# EAGLE board RTxController (EAGLE 6.5.0)
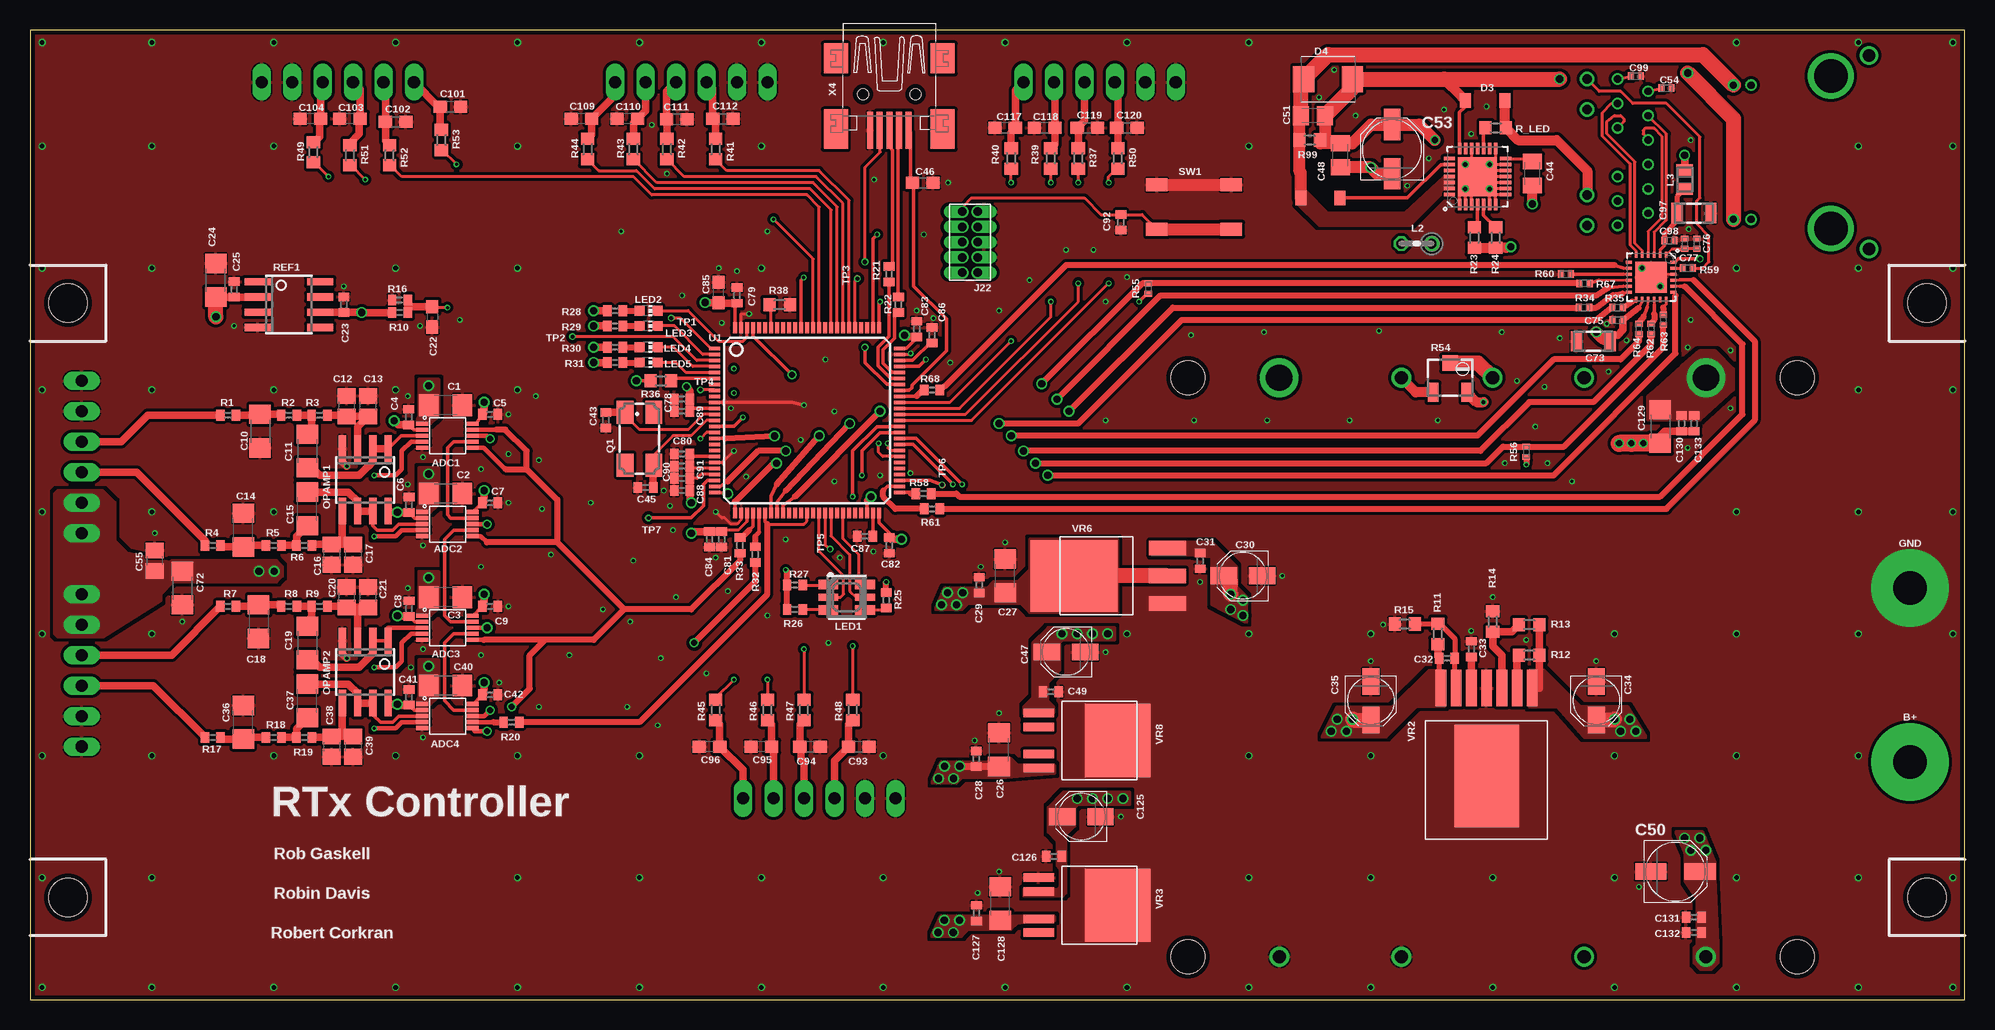
[diagram p4: board, top side]
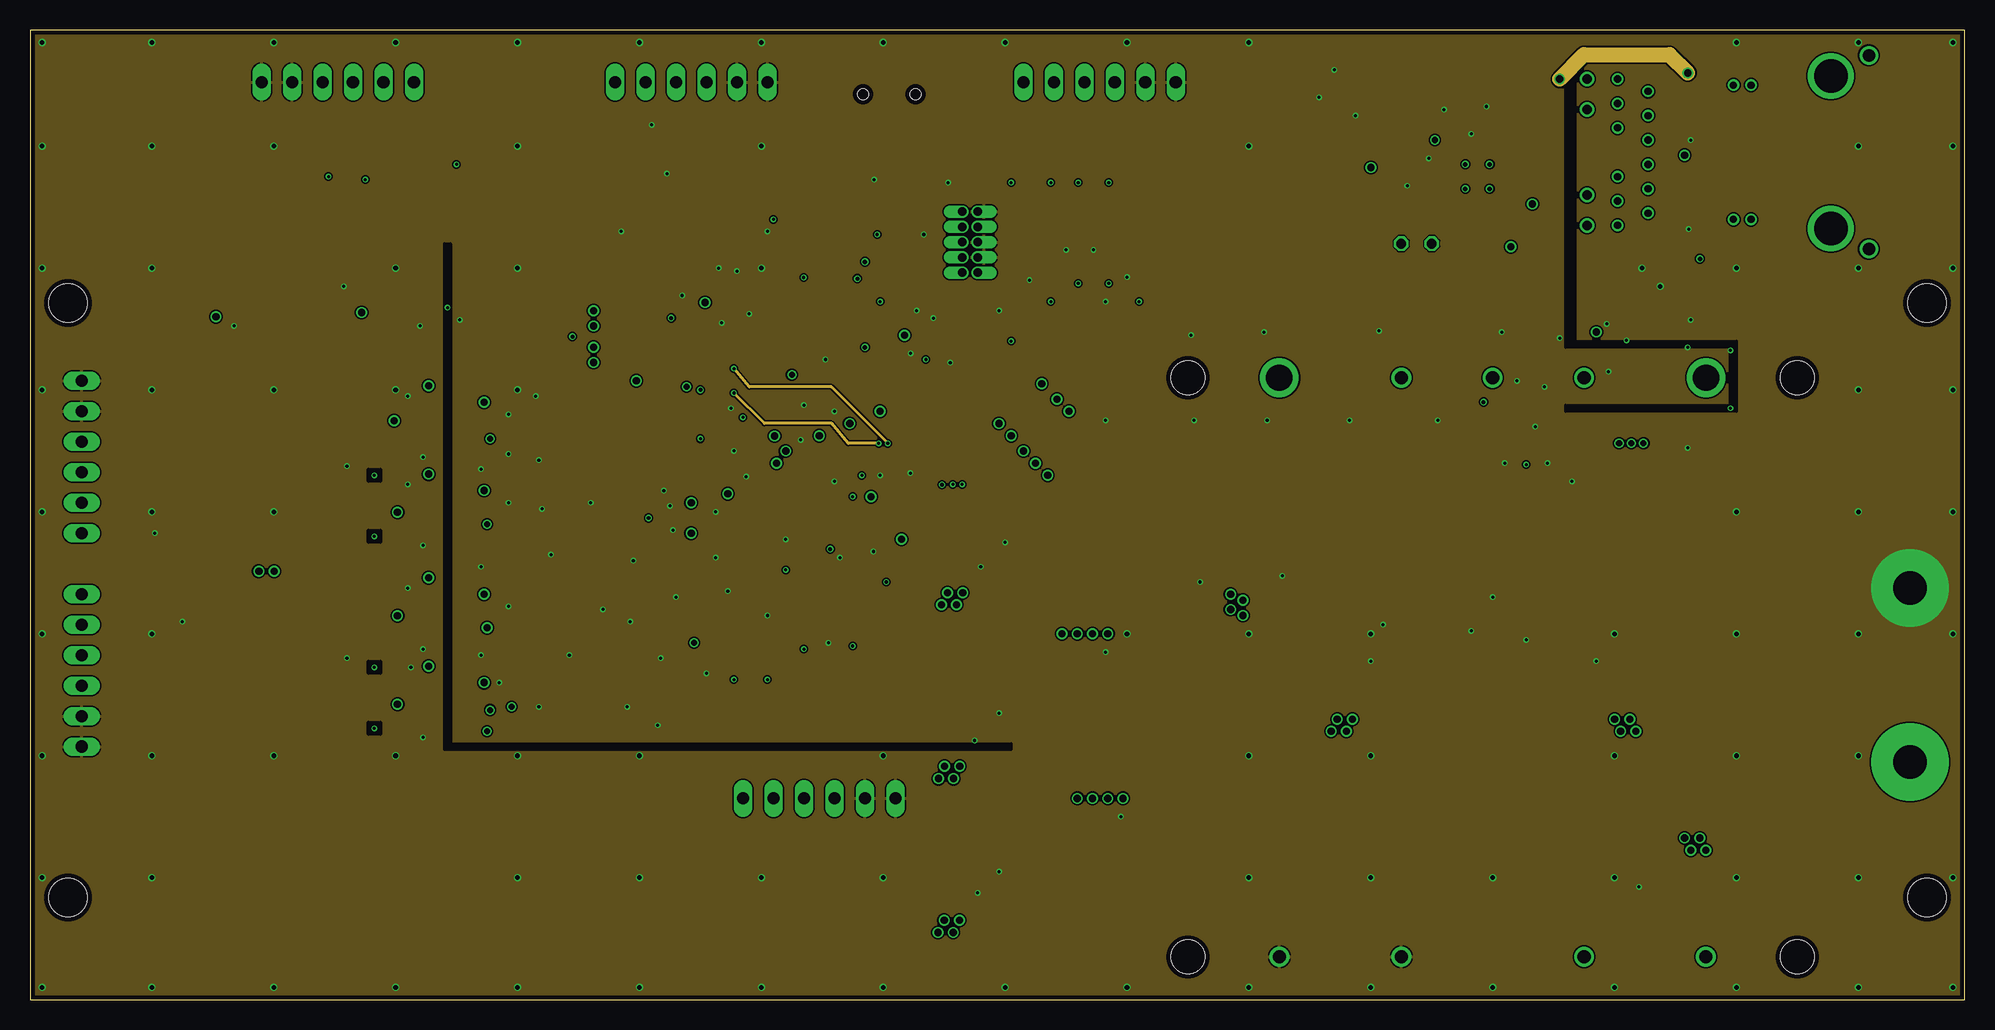
[diagram p5: board, inner layer Route2]
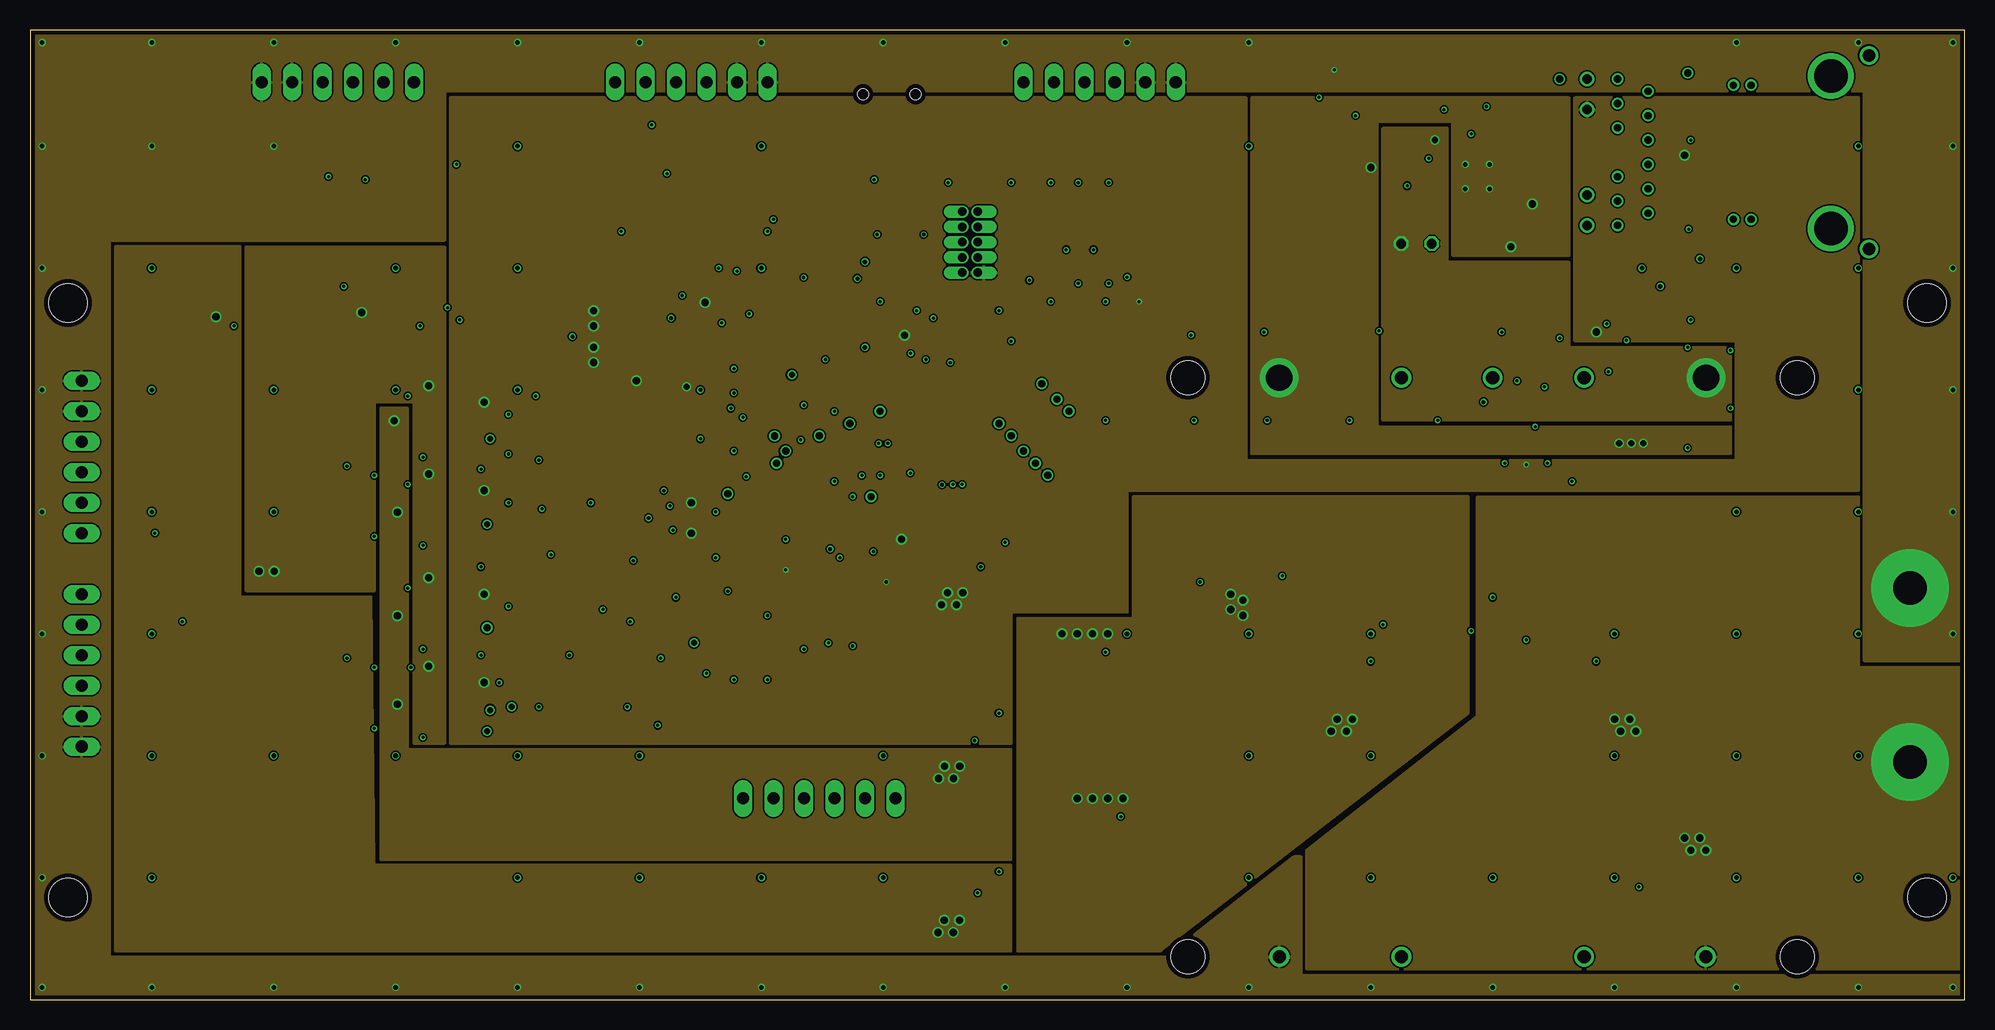
[diagram p6: board, inner layer Route3]
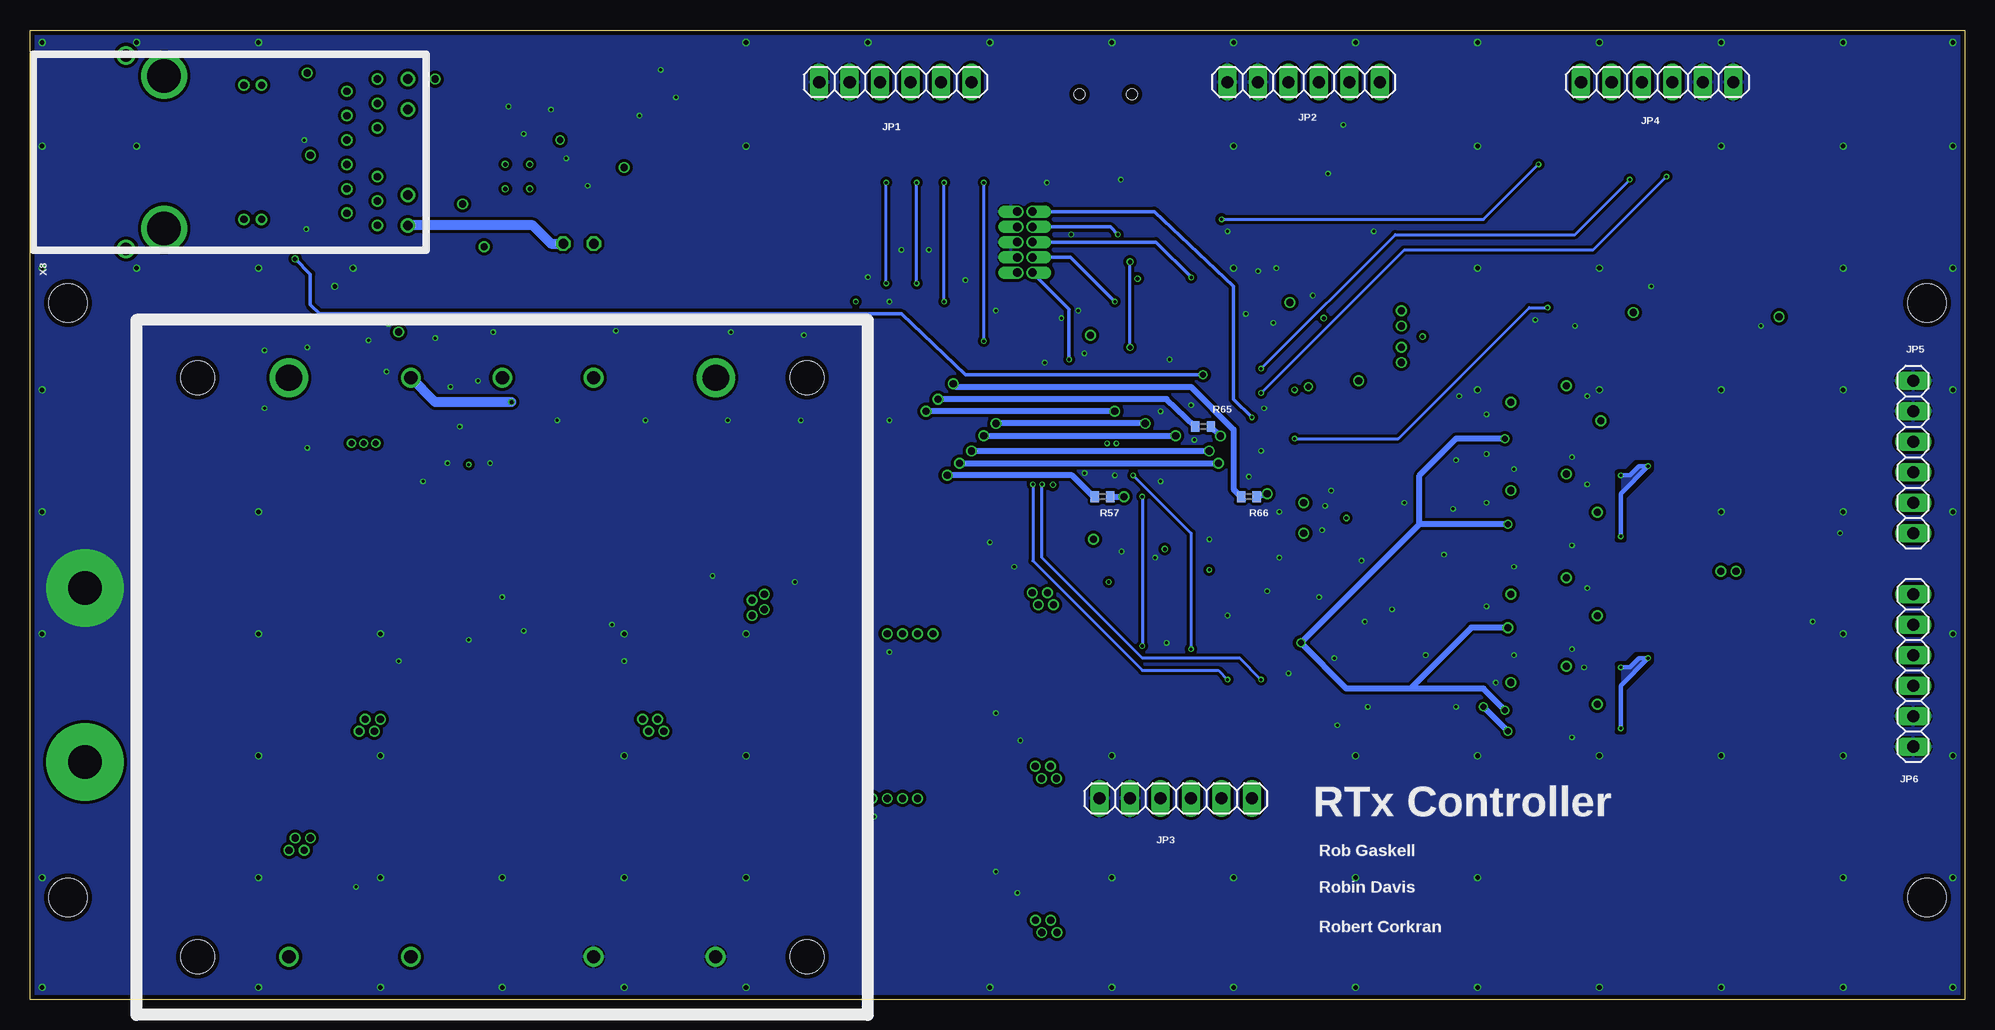
[diagram p7: board, bottom side, seen from below]

Size 161.29 x 80.8 mm. Coordinates in mm from the lower left corner, seen from the top.
Outline: 0,0 161.29,0 161.29,80.8 0,80.8 0,0
Copper layers (1+2*3+16): Top 0.035559375mm / dielectric 0.17018125mm / Route2 0.01778125mm / dielectric 47mil / Route3 0.0356mm / dielectric 0.2007mm / Bottom 0.035559375mm
Design rules "osh-park-4layer *": minimum track width 5mil, minimum drill 10mil, track to track 5mil, track to pad 5mil, pad to pad 5mil, via to via 5mil, smd to smd 5mil, copper to edge 15mil, drill to drill 5mil, minimum pad ring 7mil, minimum via ring 4mil, stop-mask expansion 3mil, vias tented up to drill 30mil, thermal gap 5mil
Net classes: 0 default: width 0.127 mm, drill 0.203 mm, clearance 0.127 mm; 1 PWR: width 0.127 mm, drill 0.203 mm, clearance 0.127 mm to class 0, clearance 0.127 mm
Holes 3.17 mm at 3.17,58.04 3.17,8.51 158.12,58.04 158.12,8.51
tRestrict: 40 lines
bRestrict: 16 lines

## Footprints (pad centres in the part's own frame; a part is rotated, then mirrored left to right if it is on the bottom)
MSOP-10 = smd 1.016 x 0.356: 1 -2.1,1; 2 -2.1,0.5; 3 -2.1,0; 4 -2.1,-0.5; 5 -2.1,-1; 6 2.1,-1; 7 2.1,-0.5; 8 2.1,0; 9 2.1,0.5; 10 2.1,1
TERMINAL_RELAY = drill 2.8 pad 6.452: P$1 0,0
C1206 = smd 1.6 x 1.8: 1 -1.4,0; 2 1.4,0
C0402 = smd 0.7 x 0.9: 1 -0.65,0; 2 0.65,0
C0805 = smd 1.3 x 1.5: 1 -0.85,0; 2 0.85,0
C0603 = smd 1.1 x 1: 1 -0.85,0; 2 0.85,0
PANASONIC_B = smd 2.2 x 1.4: + 1.6,0; - -1.6,0
C0805K = smd 1.3 x 1.6: 1 -1,0; 2 1,0
PANASONIC_C = smd 2.6 x 1.4: + 2.05,0; - -2.05,0
0402-C-NOSILK = smd 0.49 x 0.62: 1 -0.43,0; 2 0.43,0
1206-C = smd 0.95 x 1.7: 1 -1.4,0; 2 1.4,0
SOD-123 = smd 0.914 x 1.219: P$1 0,0; P$2 3.277,0
SMBJ = smd 1.78 x 2.16: A 2.04,0; C -2.03,0
TQFN-28 = smd 0.3 x 0.95: 1 -1.5,-2.34; 2 -1,-2.34; 3 -0.5,-2.34; 4 0,-2.34; 5 0.5,-2.34; 6 1,-2.34; 7 1.5,-2.34; 15 1.5,2.34; 16 1,2.34; 17 0.5,2.34; 18 0,2.34; 19 -0.5,2.34; 20 -1,2.34; 21 -1.5,2.34 | smd 0.95 x 0.3: 8 2.34,-1.5; 9 2.34,-1; 10 2.34,-0.5; 11 2.34,0; 12 2.34,0.5; 13 2.34,1; 14 2.34,1.5; 22 -2.34,1.5; 23 -2.34,1; 24 -2.34,0.5; 25 -2.34,0; 26 -2.34,-0.5; 27 -2.34,-1; 28 -2.34,-1.5 | smd 3.25 x 3.25: PAD 0,0
1.27MM_2X5 = drill 0.7 pad 1.016 offset: !RESET 1.27,-1.905; GND 0,1.905; GND@2 0,0.635; GNDDET 0,-1.905; NC/KEY 0,-0.635; TCK 1.27,1.905; TDI 1.27,-0.635; TDO 1.27,0.635; TMS 1.27,3.175; VTREF 0,3.175
1X06 = drill 1.016 long: 1 -6.35,0; 2 -3.81,0; 3 -1.27,0; 4 1.27,0; 5 3.81,0; 6 6.35,0
0204V = drill 0.813 octagon: 1 -1.27,0; 2 1.27,0
0805-C-NOSILK = smd 0.95 x 1.35: 1 -0.8,0; 2 0.8,0
PLCC-6 = smd 1.65 x 0.8: 1 -1.525,1.05; 3 -1.525,-1.05; 4 1.525,-1.05; 6 1.525,1.05 | smd 1.65 x 0.6: 2 -1.525,0; 5 1.525,0
CHIP-LED0603 = smd 0.8 x 0.8: A 0,-0.75; C 0,0.75
SOIC8 = smd 0.6 x 2.2: 1 -1.905,-2.6; 2 -0.635,-2.6; 3 0.635,-2.6; 4 1.905,-2.6; 5 1.905,2.6; 6 0.635,2.6; 7 -0.635,2.6; 8 -1.905,2.6
CHB75W = drill 1.1: 1 24.13,-17.78; 2 24.13,-7.62; 3 24.13,7.62; 4 24.13,17.78; 6 -24.13,7.62; 7 -24.13,0; 8 -24.13,-7.62 | drill 2.2: 5 -24.13,17.78; 9 -24.13,-17.78 | hole 2.8: 24.13,25.4; -24.13,25.4; 24.13,-25.4; -24.13,-25.4
CTS406 = smd 1.9 x 1.4: 1 -2.2,-1.2; 2 2.2,-1.2; 3 2.2,1.2; 4 -2.2,1.2
R0402 = smd 0.7 x 0.9: 1 -0.65,0; 2 0.65,0
R0603 = smd 1 x 1.1: 1 -0.85,0; 2 0.85,0
3223W = smd 0.9 x 1.6: 1 -1.4,-1.215; 3 1.4,-1.215 | smd 1.3 x 1.3: 2 0,1.215
COM08720 = smd 1.8 x 1.1: 1 -3.1,1.85; 2 -3.1,-1.85; 3 3.1,1.85; 4 3.1,-1.85
TP06R = smd 0.6 x 0.6: TP 0,0
LQFP-100 = smd 0.9 x 0.3: 1 -7.72,6; 2 -7.72,5.5; 3 -7.72,5; 4 -7.72,4.5; 5 -7.72,4; 6 -7.72,3.5; 7 -7.72,3; 8 -7.72,2.5; 9 -7.72,2; 10 -7.72,1.5; 11 -7.72,1; 12 -7.72,0.5; 13 -7.72,0; 14 -7.72,-0.5; 15 -7.72,-1; 16 -7.72,-1.5; 17 -7.72,-2; 18 -7.72,-2.5; 19 -7.72,-3; 20 -7.72,-3.5; 21 -7.72,-4; 22 -7.72,-4.5; 23 -7.72,-5; 24 -7.72,-5.5; 25 -7.72,-6; 51 7.72,-6; 52 7.72,-5.5; 53 7.72,-5; 54 7.72,-4.5; 55 7.72,-4; 56 7.72,-3.5; 57 7.72,-3; 58 7.72,-2.5; 59 7.72,-2; 60 7.72,-1.5; 61 7.72,-1; 62 7.72,-0.5; 63 7.72,0; 64 7.72,0.5; 65 7.72,1; 66 7.72,1.5; 67 7.72,2; 68 7.72,2.5; 69 7.72,3; 70 7.72,3.5; 71 7.72,4; 72 7.72,4.5; 73 7.72,5; 74 7.72,5.5; 75 7.72,6 | smd 0.3 x 0.9: 26 -6,-7.72; 27 -5.5,-7.72; 28 -5,-7.72; 29 -4.5,-7.72; 30 -4,-7.72; 31 -3.5,-7.72; 32 -3,-7.72; 33 -2.5,-7.72; 34 -2,-7.72; 35 -1.5,-7.72; 36 -1,-7.72; 37 -0.5,-7.72; 38 0,-7.72; 39 0.5,-7.72; 40 1,-7.72; 41 1.5,-7.72; 42 2,-7.72; 43 2.5,-7.72; 44 3,-7.72; 45 3.5,-7.72; 46 4,-7.72; 47 4.5,-7.72; 48 5,-7.72; 49 5.5,-7.72; 50 6,-7.72; 76 6,7.72; 77 5.5,7.72; 78 5,7.72; 79 4.5,7.72; 80 4,7.72; 81 3.5,7.72; 82 3,7.72; 83 2.5,7.72; 84 2,7.72; 85 1.5,7.72; 86 1,7.72; 87 0.5,7.72; 88 0,7.72; 89 -0.5,7.72; 90 -1,7.72; 91 -1.5,7.72; 92 -2,7.72; 93 -2.5,7.72; 94 -3,7.72; 95 -3.5,7.72; 96 -4,7.72; 97 -4.5,7.72; 98 -5,7.72; 99 -5.5,7.72; 100 -6,7.72
QFN-24 = smd 0.23 x 0.48: 1 -1.25,-1.86; 2 -0.75,-1.86; 3 -0.25,-1.86; 4 0.25,-1.86; 5 0.75,-1.86; 6 1.25,-1.86; 13 1.25,1.86; 14 0.75,1.86; 15 0.25,1.86; 16 -0.25,1.86; 17 -0.75,1.86; 18 -1.25,1.86 | smd 0.48 x 0.23: 7 1.86,-1.25; 8 1.86,-0.75; 9 1.86,-0.25; 10 1.86,0.25; 11 1.86,0.75; 12 1.86,1.25; 19 -1.86,1.25; 20 -1.86,0.75; 21 -1.86,0.25; 22 -1.86,-0.25; 23 -1.86,-0.75; 24 -1.86,-1.25 | smd 2.6 x 2.6: PAD 0,0
PFM-7 = smd 0.889 x 3.048: 1 -3.81,-7.671; 2 -2.54,-7.671; 3 -1.27,-7.671; 4 0,-7.671; 5 1.27,-7.671; 6 2.54,-7.671; 7 3.81,-7.671 | smd 5.359 x 8.534: PAD 0,-0.356
PG-TO252-5-11 = smd 0.711 x 2.54: 1 -2.286,-5.08; 2 -1.143,-5.08; 4 1.143,-5.08; 5 2.286,-5.08 | smd 6.096 x 5.461: 3 0,1.499
PG-TO252-3-11 = smd 3.064 x 1.2: 1 5.918,-2.286; 2 5.918,0; 3 5.918,2.311 | smd 7.269 x 5.969: 4 -1.88,0
32005-301 = smd 3.1 x 0.5: 1 3,1.6; 2 3,0.8; 3 3,0; 4 3,-0.8; 5 3,-1.6 | smd 2.5 x 2: M1 -3,-4.45; M2 -3,4.45 | smd 3.3 x 2: M3 2.9,4.45; M4 2.9,-4.45 | hole 0.9: 0,2.2; 0,-2.2
MAGJACK-RJ45 = drill 0.6 pad 0.889: 1 -5.08,-15.24; 2 -3.048,-15.24; 3 -1.016,-15.24; 4 1.016,-15.24; 5 3.048,-15.24; 6 5.08,-15.24; 7 -6.096,-17.78; 8 -4.064,-17.78; 9 -2.032,-17.78; 10 2.032,-17.78; 11 4.064,-17.78; 12 6.096,-17.78; 13 -5.588,-8.128; 14 5.588,-8.128; 15 -5.588,-6.655; 16 5.588,-6.655 | drill 0.8 pad 1.016: 17 -6.096,-20.32; 18 -3.556,-20.32; 19 3.556,-20.32; 20 6.096,-20.32 | drill 1.016 pad 1.575: SHIELD1 -8.065,3.175; SHIELD2 8.065,3.175 | drill 2.8 pad 3.251: SHIELD3 -6.35,0; SHIELD4 6.35,0

## Placement (x,y rotation side)
ADC1  AD7685RM-10  [MSOP-10]  34.8,46.99 0 top
ADC2  AD7685RM-10  [MSOP-10]  34.8,39.62 0 top
ADC3  AD7685RM-10  [MSOP-10]  34.8,30.99 0 top
ADC4  AD7685RM-10  [MSOP-10]  34.8,23.62 0 top
B+  TERMINAL  [TERMINAL_RELAY]  156.72,19.81 0 top
C1  22u  [C1206]  34.65,49.53 180 top
C2  22u  [C1206]  34.65,42.16 180 top
C3  22u  [C1206]  34.65,33.53 180 top
C4  0.1u  [C0402]  31.57,48.54 90 top
C5  0.1u  [C0402]  38.35,48.77 0 top
C6  0.1u  [C0402]  31.6,41.22 90 top
C7  0.1u  [C0402]  38.35,41.4 0 top
C8  0.1u  [C0402]  31.6,32.59 90 top
C9  0.1u  [C0402]  38.35,32.77 0 top
C10  10u  [C1206]  19.18,47.37 270 top
C11  10u  [C1206]  23.11,45.72 270 top
C12  1u  [C0805]  26.42,49.45 90 top
C13  0.47u  [C0805]  28.19,49.45 90 top
C14  10u  [C1206]  17.78,39.12 90 top
C15  10u  [C1206]  23.11,40.89 90 top
C16  1u  [C0805]  25.15,37.08 270 top
C17  0.47u  [C0805]  26.92,37.08 270 top
C18  10u  [C1206]  19.05,31.5 270 top
C19  10u  [C1206]  23.11,29.72 270 top
C20  1u  [C0805]  26.42,33.53 90 top
C21  0.47u  [C0805]  28.19,33.53 90 top
C22  0.33u  [C0603]  33.53,56.9 270 top
C23  0.1u  [C0402]  26.16,57.91 90 top
C24  10u  [C1206]  15.49,59.94 90 top
C25  0.1u  [C0402]  17.02,59.18 90 top
C26  22u  [C1206]  80.77,20.83 90 top
C27  22u  [C1206]  81.28,35.31 90 top
C28  0.1u  [C0402]  78.87,20.07 90 top
C29  0.1u  [C0402]  79.12,34.54 90 top
C30  10u  [PANASONIC_B]  101.09,35.31 180 top
C31  0.1u  [C0402]  97.54,36.55 270 top
C32  0.022u  [C0402]  118.11,28.45 180 top
C33  4700p  [C0402]  120.14,29.21 270 top
C34  22u 50V  [PANASONIC_B]  130.56,24.89 270 top
C35  47u 16V  [PANASONIC_B]  111.76,24.89 270 top
C36  10u  [C1206]  17.78,23.11 90 top
C37  10u  [C1206]  23.11,24.89 90 top
C38  1u  [C0805]  25.15,21.08 270 top
C39  0.47u  [C0805]  26.92,21.08 270 top
C40  22u  [C1206]  34.65,26.16 180 top
C41  0.1u  [C0402]  31.6,25.2 90 top
C42  0.1u  [C0402]  38.35,25.4 0 top
C43  16p  [C0402]  48.01,48.29 270 top
C44  100nF  [C0805K]  125.22,68.83 270 top
C45  16p  [C0402]  51.31,42.67 180 top
C46  [C0603]  74.42,68.07 0 top
C47  10u  [PANASONIC_B]  86.36,28.96 180 top
C48  0.1uf 100V  [C0805K]  109.22,70.36 270 top
C49  0.1u  [C0402]  85.09,25.65 0 top
C50  47u 50V  [PANASONIC_C]  137.16,10.67 0 top
C51  0.1uf 100V  [C0805K]  106.93,73.66 180 top
C53  47u 100V  [PANASONIC_C]  113.54,70.87 90 top
C54  100n  [0402-C-NOSILK]  136.4,75.95 180 top
C55  1u  [C0805]  10.41,36.58 90 top
C72  22u  [C1206]  12.7,34.29 270 top
C73  22u  [1206-C]  130.3,54.86 0 top
C75  100n  [0402-C-NOSILK]  132.33,56.62 0 top
C76  100n  [0402-C-NOSILK]  138.94,62.99 90 top
C77  2.2u  [0402-C-NOSILK]  137.92,62.99 90 top
C78  0.1u  [C0402]  54.36,50.04 180 top
C79  0.1u  [C0402]  58.93,58.67 90 top
C80  0.1u  [C0402]  54.36,45.47 180 top
C81  0.1u  [C0402]  57.66,38.35 270 top
C82  0.1u  [C0402]  71.63,37.85 270 top
C83  0.1u  [C0402]  73.91,55.88 90 top
C84  0.1u  [C0402]  56.64,38.35 270 top
C85  4.7u  [C0603]  57.4,58.93 90 top
C86  2.2u  [C0402]  75.18,55.37 90 top
C87  2.2u  [C0402]  69.6,38.61 180 top
C88  0.1u  [C0402]  54.36,42.42 180 top
C89  1.0u  [C0402]  54.36,49.02 180 top
C90  0.1u  [C0402]  54.36,43.43 180 top
C91  1.0u  [C0402]  54.36,44.45 180 top
C92  NU  [C0402]  90.93,64.77 270 top
C93  0.1u  [C0603]  69.09,21.08 0 top
C94  0.1u  [C0603]  65.02,21.08 0 top
C95  0.1u  [C0603]  60.96,21.08 180 top
C96  0.1u  [C0603]  56.64,21.08 180 top
C97  22u  [1206-C]  138.68,65.53 180 top
C98  100n  [0402-C-NOSILK]  136.65,63.25 180 top
C99  100n  [0402-C-NOSILK]  133.86,76.96 180 top
C101  0.1u  [C0603]  35.05,74.42 0 top
C102  0.1u  [C0603]  30.48,73.15 0 top
C103  0.1u  [C0603]  26.67,73.41 180 top
C104  0.1u  [C0603]  23.37,73.41 180 top
C109  0.1u  [C0603]  45.97,73.41 180 top
C110  0.1u  [C0603]  49.78,73.41 180 top
C111  0.1u  [C0603]  53.92,73.38 0 top
C112  0.1u  [C0603]  57.76,73.41 0 top
C117  0.1u  [C0603]  81.28,72.64 180 top
C118  0.1u  [C0603]  84.58,72.64 180 top
C119  0.1u  [C0603]  88.14,72.64 0 top
C120  0.1u  [C0603]  91.44,72.64 0 top
C125  10u  [PANASONIC_B]  87.63,15.24 180 top
C126  0.1u  [C0402]  85.34,11.94 180 top
C127  0.1u  [C0402]  78.89,7.21 90 top
C128  22u  [C1206]  80.87,8 90 top
C129  10u 50V  [C1206]  135.89,47.75 270 top
C130  0.1u 50V  [C0402]  137.67,48.01 270 top
C131  0.1u 50V  [C0402]  138.68,6.86 180 top
C132  0.1u 50V  [C0402]  138.68,5.59 180 top
C133  0.1u 50V  [C0402]  138.71,48.01 270 top
D3  1N4448  [SOD-123]  122.94,74.93 180 top
D4  SMAJ58A  [SMBJ]  108.2,76.71 180 top
D5  1N4448  [SOD-123]  105.92,66.8 0 top
GND  TERMINAL  [TERMINAL_RELAY]  156.72,34.29 0 top
IC2  MAX5984A  [TQFN-28]  120.65,68.58 0 top
J22  Debug Header  [1.27MM_2X5]  78.99,63.75 180 top
JP1  [1X06]  89.15,76.45 0 bottom
JP2  [1X06]  55.12,76.45 180 bottom
JP3  [1X06]  65.79,16.76 0 bottom
JP4  [1X06]  25.65,76.45 0 bottom
JP5  [1X06]  4.32,45.21 90 bottom
JP6  [1X06]  4.32,27.43 90 bottom
L2  10m, 21mA  [0204V]  115.57,62.99 180 top
L3  FB0805/600R/200mA(201209-601)  [0805-C-NOSILK]  137.92,68.33 90 top
LED1  [PLCC-6]  68.07,33.53 0 top
LED2  [CHIP-LED0603]  51.56,57.4 270 top
LED3  [CHIP-LED0603]  51.56,56.13 270 top
LED4  [CHIP-LED0603]  51.56,54.36 270 top
LED5  [CHIP-LED0603]  51.56,53.09 270 top
OPAMP1  AD8616R-8  [SOIC8]  27.94,43.31 180 top
OPAMP2  AD8616R-8  [SOIC8]  27.94,27.3 180 top
POE  CHB75W  [CHB75W]  121.92,27.69 270 bottom
Q1  [CTS406]  50.8,46.74 270 top
R1  680  [R0402]  16.51,48.69 0 top
R2  2.2k  [R0402]  21.59,48.69 0 top
R3  1.2k  [R0402]  24.13,48.69 0 top
R4  680  [R0402]  15.24,37.85 0 top
R5  2.2k  [R0402]  20.32,37.85 0 top
R6  1.2k  [R0402]  22.86,37.85 0 top
R7  680  [R0402]  16.51,32.77 0 top
R8  2.2k  [R0402]  21.59,32.77 0 top
R9  1.2k  [R0402]  24.13,32.77 0 top
R10  10k  [R0402]  30.84,57.25 0 top
R11  34k  [R0603]  117.35,30.48 270 top
R12  249k  [R0603]  124.97,28.7 180 top
R13  150k  [R0603]  124.97,31.24 180 top
R14  10k  [R0603]  121.92,31.5 270 top
R15  2.43k  [R0603]  114.6,31.29 0 top
R16  19.1k  [R0402]  30.84,58.29 0 top
R17  680  [R0402]  15.24,21.84 0 top
R18  2.2k  [R0402]  20.32,21.84 0 top
R19  1.2k  [R0402]  22.86,21.84 0 top
R20  33  [R0402]  40.13,23.11 0 top
R21  22  [R0402]  71.6,60.45 270 top
R22  22  [R0402]  72.39,57.91 270 top
R23  1k  [R0603]  120.4,63.5 270 top
R24  1k  [R0603]  122.17,63.5 270 top
R25  750  [R0402]  71.37,33.27 270 top
R26  750  [R0402]  63.75,32.51 0 top
R27  750  [R0402]  63.75,34.54 0 top
R28  750  [R0402]  48.77,57.4 0 top
R29  750  [R0402]  48.77,56.13 0 top
R30  750  [R0402]  48.77,54.36 0 top
R31  750  [R0402]  48.77,53.09 0 top
R32  33  [R0402]  60.45,37.08 90 top
R33  33  [R0402]  59.18,37.85 90 top
R34  33  [0402-C-NOSILK]  129.54,57.66 180 top
R35  33  [0402-C-NOSILK]  132.33,57.66 180 top
R36  0  [R0603]  52.58,51.56 0 top
R37  200  [R0603]  87.38,70.1 270 top
R38  10k  [R0603]  62.48,57.91 0 top
R39  200  [R0603]  85.09,70.1 270 top
R40  200  [R0603]  81.79,70.1 270 top
R41  200  [R0603]  57.15,70.87 270 top
R42  200  [R0603]  53.09,70.87 270 top
R43  200  [R0603]  50.29,70.87 270 top
R44  200  [R0603]  46.48,70.87 270 top
R45  200  [R0603]  57.15,24.13 90 top
R46  200  [R0603]  61.47,24.13 90 top
R47  200  [R0603]  64.52,24.13 90 top
R48  200  [R0603]  68.58,24.13 90 top
R49  200  [R0603]  23.62,70.61 270 top
R50  200  [R0603]  90.68,70.1 270 top
R51  200  [R0603]  26.67,70.36 270 top
R52  200  [R0603]  29.97,70.36 270 top
R53  200  [R0603]  34.29,71.63 270 top
R54  10k  [3223W]  118.36,51.82 0 top
R55  1k  [0402-C-NOSILK]  93.22,59.26 90 top
R56  1k  [0402-C-NOSILK]  124.71,45.64 90 top
R57  33  [R0402]  71.88,41.91 180 bottom
R58  33  [R0402]  74.47,42.16 0 top
R59  1k  [0402-C-NOSILK]  138.18,60.96 0 top
R60  6.49k  [0402-C-NOSILK]  128.02,60.45 0 top
R61  33  [R0402]  75.18,40.89 0 top
R62  33  [0402-C-NOSILK]  135.13,55.88 270 top
R63  33  [0402-C-NOSILK]  136.14,56.64 270 top
R64  33  [0402-C-NOSILK]  134.11,55.88 270 top
R65  33  [R0402]  63.5,47.75 180 bottom
R66  33  [R0402]  59.69,41.91 180 bottom
R67  33  [0402-C-NOSILK]  129.59,59.69 180 top
R68  33  [R0402]  75.18,50.8 0 top
R99  2.2M  [R0603]  106.68,71.63 180 top
R_LED  1k  [R0603]  122.17,72.64 0 top
REF1  ADR435RM-8  [SOIC8]  21.59,57.91 270 top
SW1  COM08720  [COM08720]  97.03,66.04 180 top
TP1  TPTP06R  [TP06R]  53.44,56.79 0 top
TP2  TPTP06R  [TP06R]  45.21,55.24 90 top
TP3  TPTP06R  [TP06R]  68.96,60.07 0 top
TP4  TPTP06R  [TP06R]  55.88,50.8 0 top
TP5  TPTP06R  [TP06R]  66.7,37.54 0 top
TP6  TPTP06R  [TP06R]  76.02,42.9 0 top
TP7  TPTP06R  [TP06R]  51.56,40.13 0 top
U1  STM32F407ZXT  [LQFP-100]  64.77,48.26 0 top
U3  KSZ8081  [QFN-24]  135.13,60.2 180 top
VR2  LMZ14202HTZ  [PFM-7]  121.41,18.29 180 top
VR3  TL751M08QKVURQ1  [PG-TO252-5-11]  89.15,7.87 270 top
VR6  TLV1117-33IKVU  [PG-TO252-3-11]  88.9,35.31 0 top
VR8  TLE4275-QKVU  [PG-TO252-5-11]  89.15,21.59 270 top
X4  MINI-USB-32005-301  [32005-301]  71.63,75.44 270 top
X8  0826-1X1T-GJ-F  [MAGJACK-RJ45]  150.11,70.61 90 bottom

## Tracks (layer width: path | path; a pad name or v marks a point on that pad's centre or on a via)
+3.3V  (via drill 0.25, 0.5, 0.6)
  Top 0.203: U3.14 134.38,58.18 134.09,57.63
  Top 0.254: C5.1 37.23,48.06 ADC1.10 | 59.77,39.85 59.04,39.12 57.91,39.12 57.8,39 C81.1 | U1.21 54.94,44.26 arc-90 C91.1 | U1.22 55.95,43.76 55.63,43.43 55.12,43.43 54.86,43.18 55.01,42.93
  Top 0.305: U1.28 59.77,39.85 | ADC3.10 36.93,31.99 C9.1 | ADC4.10 36.93,24.62 C42.1 | C83.1 73.91,55.12 73.06,54.26 U1.75 | R36.1 v50.55,51.56 | C80.1 54.7,45.26 U1.19 | U1.11 55.26,49.26 55.01,49.28 | C79.1 58.77,58.18 U1.100 | C82.1 71.63,38.86 70.77,39.72 U1.50 | C7.1 37.68,41.4 ADC2.10 | R55.1 93.12,58.83 v92.46,58.17
  Top 0.508: 134.09,57.63 C75.2 | R26.1 R27.1 63.1,35.7 v62.99,35.81 | R25.1 v71.37,34.8 | R56.1 v124.71,44.58
  Top 0.61: C80.1 C91.1 C90.1 55.01,42.93 C88.1 55.01,41.51 v55.12,41.4 | C89.1 55.01,49.28 C78.1 55.01,50.71 v54.71,51.05 | R30.1 v46.99,54.36 | R31.1 v46.99,53.09 | C79.1 57.2,58.02 C85.1 56.73,58.08 v56.26,58.09 | R29.1 v46.99,56.13 | C82.1 71.77,38.35 v72.64,38.35 | C7.1 37.85,41.54 v37.85,42.42 | C9.1 37.85,32.91 v37.85,33.78 | C42.1 37.85,25.54 v37.85,26.42 | C5.1 37.85,48.91 v37.85,49.78 | C81.1 C84.1 55.26,39 v55.12,38.86 | L3.2 v137.92,70.36 | C83.1 73.04,55.23 v72.9,55.37 | R28.1 v46.99,57.4 | C75.2 132.76,55.8 132.33,55.37 131.96,55.37 C73.2
  Top 1.016: v130.56,55.63 131.06,55.12 C73.2
  Top 1.27: VR6.2 VR6.4
  other vias: 77.75,33.91 76.48,33.91 77.24,32.89 75.97,32.89
  pour Route3: 91.44,42.42 91.44,32.26 81.79,32.26 81.79,21.34 35.05,21.34 35.05,75.18 101.35,75.18 101.35,44.96 142.24,44.96 142.24,54.86 128.78,54.86 128.78,75.18 152.4,75.18 152.4,42.42
  pour Top (no thermals): 90.68,38.35 83.31,38.35 83.31,35.81 82.3,34.8 80.26,34.8 79.76,34.29 76.2,34.29 75.44,32.51 77.72,32.51 78.23,33.02 82.55,33.02 83.31,32.26 90.68,32.26
+5.000VREF  (via drill 0.6)
  Top 0.61: 33.27,49.56 C1.2 | R10.1 v27.64,57.25 27.38,57.26 C23.1 26.15,57.28 REF1.6
  Top 1.27: 10.45,35.69 C55.1
  other vias: 33.22,51.16 33.22,43.79 33.22,35.15 33.22,27.79 20.35,35.69 19.08,35.69
  pour Top (no thermals): 32.18,40.79 32.44,41.25 32.44,44.35 34.06,44.35 34.06,41.25 33.25,40.44 32.18,40.44
  pour Top (no thermals): 32.18,48.16 32.44,48.62 32.44,51.71 34.06,51.71 34.06,48.62 33.25,47.8 32.18,47.8
  pour Top (no thermals): 32.18,32.16 32.44,32.61 32.44,35.71 34.06,35.71 34.06,32.61 33.25,31.8 32.18,31.8
  pour Top (no thermals): 32.18,24.79 32.44,25.25 32.44,28.35 34.06,28.35 34.06,25.25 33.25,24.43 32.18,24.43
  pour Route3: 18.03,62.74 34.54,62.74 34.54,21.34 32,21.34 32,49.78 28.7,49.78 28.7,34.04 18.03,34.04
  pour Top (no thermals): 21.08,36.07 20.57,36.58 11.79,36.58 11.66,36.45 8.13,37.21 7.11,38.23 7.11,41.4 6.1,42.42 2.29,42.42 2.03,42.16 2.03,30.48 2.29,30.23 6.1,30.23 10.92,33.27 10.92,33.78 11.94,34.8 20.57,34.8 21.08,35.31
+5V  (via drill 0.6)
  Top 0.305: ADC3.2 32.05,31.49 C8.1 | ADC4.2 32.02,24.12 C41.1 | ADC2.2 32.05,40.12 C6.1 | ADC1.2 31.97,47.49 C4.1
  Top 0.61: C26.1 80.77,19.68 arc-90 80.53,19.45 C28.1 77.51,19.45 v77.5,19.43 | C41.1 30.7,24.55 v30.63,24.61 29.94,24.61 OPAMP2.8 | C8.1 30.67,31.94 v30.63,31.98 | C6.1 30.67,40.57 v30.63,40.62 29.94,40.62 OPAMP1.8 | C4.1 30.7,47.89 v30.35,48.23
  other vias: 76.23,19.43 76.99,18.41 75.72,18.41
  pour Route3: 29.21,11.68 81.79,11.68 81.79,20.83 31.5,20.83 31.5,49.28 29.21,49.28
  pour Top (no thermals): 85.42,19.51 82.35,19.51 81.81,20.07 80.01,20.07 79.76,19.81 75.9,19.76 75.13,18.08 77.22,18.03 77.72,18.54 81.41,18.54 85.42,18.85
+8V  (via drill 0.6)
  Top 0.61: C24.1 17.01,58.54 C25.1 18.98,58.53 REF1.2 | C128.1 80.84,6.56 | C127.1 78.85,6.6
  Top 1.27: v15.49,56.9 C24.1
  other vias: 77.47,6.6 76.2,6.6 76.96,5.59 75.69,5.59
  pour Route3: 7.11,62.74 7.11,4.06 81.79,4.06 81.79,11.18 28.7,11.18 28.45,33.53 17.53,33.53 17.53,62.74
  pour Top (no thermals): 85.42,6.93 75.87,6.93 75.11,5.26 77.65,5.26 78.23,5.84 81.79,5.84 82.3,6.35 84.07,6.6 85.42,6.55
+9-36V  (via drill 0.6)
  Top 0.61: 125.22,27.18 VR2.1 125.82,25.96 R12.1 R13.1
  Top 1.27: v132.08,23.37 132,23.29 C34.+
  other vias: 133.35,23.37 138.43,12.45 139.19,13.46 137.92,13.46 132.59,22.35 133.86,22.35 139.7,12.45
  pour Route3: 161.29,27.69 161.29,2.54 106.43,2.54 106.43,12.45 120.65,23.62 120.65,41.91 152.4,41.91 152.4,27.69
  pour Top (no thermals): 137.92,9.91 138.94,8.38 138.94,4.57 138.68,4.32 138.68,3.05 139.19,2.54 140.21,2.54 140.72,3.05 140.72,4.57 140.46,10.16 140.46,11.43 139.45,13.97 137.16,13.97 137.92,12.19
  pour Top (no thermals): 133.2,24.38 129.29,24.38 126.24,27.43 124.97,27.43 124.97,24.38 127.25,24.38 129.54,21.84 134.72,21.84
+12V  (via drill 0.6)
  Top 0.254: VR2.7 117.6,26.92
  Top 0.406: 117.6,26.92 117.46,26.92 C32.2 117.35,28.56
  Top 0.61: C30.+ 99.49,35.75 | 95.16,37.7 VR6.3 | 117.35,28.56 R11.2
  Top 1.27: v110.24,23.37 110.31,23.29 C35.+ | v100.08,33.78 100.08,34.72 arc90 C30.+
  other vias: 87.3,16.76 108.97,23.37 100.08,32.51 88.57,16.76 86.03,30.48 87.3,30.48 88.57,30.48 89.84,30.48 101.09,33.27 101.09,32 109.73,22.35 108.46,22.35 89.84,16.76 91.11,16.76
  pour Route3: 119.89,41.91 91.95,41.91 91.95,31.75 82.3,31.75 82.3,4.06 94.23,4.06 119.89,23.88
  pour Top (no thermals): 101.42,31.42 101.42,33.58 100.58,34.42 100.58,36.07 98.55,38.1 93.47,38.1 93.47,37.08 96.52,37.08 98.48,36.88 98.48,32.94
  pour Top (no thermals): 108.97,24.38 113.54,24.38 116.59,27.43 117.86,27.43 117.86,24.38 115.57,24.38 113.03,21.84 107.7,21.84
  pour Top (no thermals): 90.42,30.99 84.84,30.99 83.57,29.72 83.57,25.15 82.8,24.38 82.8,23.88 85.34,23.88 85.34,24.38 84.84,24.89 84.84,26.42 85.85,27.43 85.85,29.72 86.11,29.97 90.42,29.97
  pour Top (no thermals): 91.69,17.27 86.11,17.27 84.84,16 84.84,13.97 85.6,13.21 85.6,11.43 85.6,11.18 85.85,10.92 85.85,9.4 85.6,9.14 82.8,9.14 82.8,8.64 86.11,8.64 86.36,8.89 86.36,13.72 87.12,14.48 87.12,16 87.38,16.26 91.69,16.26
ACTIVITY_LED
  Top 0.254: U3.23 R59.1
ADC1_IN+
  Top 0.305: ADC1.3 30.93,46.99 OPAMP1.1
  Top 0.61: OPAMP1.1 OPAMP1.2 28.57,44.81 28.22,44.45 28.19,44.45 27.43,43.69 24.13,43.69 23.5,44.32 C11.2
ADC2_IN+
  Top 0.305: OPAMP1.7 28.57,39.47 28.93,39.12 30.23,39.12 30.73,39.62 ADC2.3
  Top 0.61: C15.2 26.54,42.29 27.3,41.53 OPAMP1.6 OPAMP1.7
ADC3_IN+
  Top 0.305: OPAMP2.1 OPAMP2.2
  Top 0.356: OPAMP2.1 29.84,30.99 ADC3.3
  Top 0.61: OPAMP2.2 28.57,28.83 27.43,27.69 24.13,27.69 23.5,28.32 C19.2 arc90 23.24,28.19
ADC4_IN
  Top 0.305: OPAMP2.7 28.57,23.75 29.21,23.11 30.23,23.11 30.73,23.62 ADC4.3
  Top 0.61: OPAMP2.7 OPAMP2.6 27.3,25.53 26.54,26.29 C37.2
ADC_CNV  (via drill 0.5)
  Top 0.305: ADC1.9
  Top 0.356: 39.62,44.2 37.83,45.99 ADC1.6 | ADC3.6 37.83,29.99 37.85,29.97 | ADC4.6 37.07,22.37 v38.1,22.35 | 38.1,38.1 37.58,38.62 ADC2.6 | ADC1.9 37.58,47.49 37.85,47.5 38.86,47.5
  Top 0.508: 49.53,32.51 55.12,32.51 59.18,36.58 R33.1 | 49.53,32.51 43.94,38.1 | v40.13,24.38 41.66,25.91 41.66,28.7 42.93,29.97 | 43.94,38.1 38.1,38.1 | 39.62,44.2 41.4,44.2 | 41.4,44.2 43.94,41.66 43.94,38.1 | 41.4,44.2 41.4,45.72 39.62,47.5 38.86,47.5 | 49.53,32.51 46.99,29.97 42.93,29.97 | 42.93,29.97 37.85,29.97
  Bottom 0.508: v38.1,22.35 v40.13,24.38
AXIS3_IN
  Top 0.61: JP6.4 11.8,28.7 R7.1
AXIS4_IN
  Top 0.61: JP6.3 10.27,26.16 R17.1
BOOT0
  Top 0.254: U1.94 61.77,56.01 61.77,57.73 R38.1
D+
  Top 0.254: R22.1 72.39,58.52 72.34,58.57 | 72.34,72.35 X4.2
  Top 0.305: 72.34,58.57 72.34,72.35
D-
  Top 0.254: R21.1 71.63,60.96 71.91,61.34 | 71.63,71.07 X4.3
  Top 0.305: 71.91,61.34 71.91,70.79 71.63,71.07
ENABLE_AXIS3_OUT
  Top 0.254: U1.81 68.27,56.51 68.28,56.52 68.28,66.6 65.79,69.09 58.08,69.09 R41.2
ENABLE_AXIS4_OUT
  Top 0.254: U1.83 67.27,56.42 67.28,56.44 67.28,66.06 65.28,68.07 52.24,68.07 R43.2
ENABLE_LAT_OUT  (via drill 0.25)
  Top 0.254: R51.2 26.67,69.6 v27.94,68.33 | 72.1,45.76 U1.58 71.72,45.76 71.5,45.97 v71.5,46.35
  Route2 0.254: v58.67,52.58 59.94,51.05 66.8,51.05 v71.5,46.35
  Bottom 0.254: v58.67,52.58 47.5,63.75 32.51,63.75 v27.94,68.33
ENABLE_VERT_OUT  (via drill 0.25)
  Top 0.254: U1.87 65.28,61.72 v61.98,65.02 | R53.2 34.29,70.87 v35.56,69.6
  Top 0.305: U1.87
  Bottom 0.254: v61.98,65.02 40.13,65.02 v35.56,69.6
EPHY_NRST  (via drill 0.38, 0.5)
  Top 0.203: U3.24 137.14,61.45 137.41,61.72
  Top 0.254: U1.97
  Top 0.305: v63.5,52.07 60.27,55.3 U1.97 | 137.41,61.72 v139.19,61.72
  Bottom 0.305: v63.5,52.07 83.31,52.07 88.65,57.15 137.16,57.15 137.92,57.91 137.92,60.45 v139.19,61.72
ETH_CRS_DV  (via drill 0.6)
  Top 0.305: 62.23,42.93 61.77,41.96 U1.32
  Top 0.508: R64.2 134.11,54.86 132.59,53.34 127,53.34 120.65,46.99 v81.79,46.99 | 62.23,42.93 v65.79,46.99
  Bottom 0.508: v81.79,46.99 v65.79,46.99
ETH_MDC  (via drill 0.6)
  Top 0.203: U3.11 132.8,59.45
  Top 0.305: 132.8,59.45 131.6,59.33
  Top 0.508: v85.6,50.04 94.23,58.67 130.56,58.67 131.27,59.16 131.6,59.33
  Bottom 0.508: R65.2 66.55,50.04 v85.6,50.04
ETH_MDINT  (via drill 0.6)
  Top 0.305: 58.77,41.5 U1.26
  Top 0.508: v83.82,44.7 121.41,44.7 122.78,46.08 R56.2 | R63.2 136.14,54.36 127.86,46.08 124.79,46.08 R56.2 | v62.23,44.7 61.98,44.7 58.77,41.5 | R56.2
  Bottom 0.508: v83.82,44.7 v62.23,44.7
ETH_MDIO  (via drill 0.6)
  Top 0.508: R67.2 92.71,59.69 | 92.71,59.69 v84.33,51.31 | R55.2 92.71,59.69
  Bottom 0.508: R66.2 60.96,42.53 60.96,47.5 64.52,51.05 84.07,51.05 v84.33,51.31
ETH_RMII_REF_CLK  (via drill 0.6)
  Top 0.305: U1.24 57.57,42.76 58.17,43.18
  Top 0.508: v82.8,45.72 120.9,45.72 124.97,49.78 130.3,49.78 135.13,54.61 R62.2 | v62.99,45.72 60.71,45.72 58.17,43.18
  Bottom 0.508: v82.8,45.72 v62.99,45.72
ETH_RXD0  (via drill 0.6)
  Top 0.305: U1.33 62.27,41.44 62.99,42.42
  Top 0.508: v80.77,48.01 87.38,48.01 96.01,56.64 130.56,56.64 131.83,57.66 R35.2 | 62.99,42.42 v68.33,48.01
  Bottom 0.508: v68.33,48.01 v80.77,48.01
ETH_RXD1  (via drill 0.6)
  Top 0.305: U1.34 62.77,41.18 63.75,41.91
  Top 0.508: v86.61,49.02 95.25,57.66 R34.2 | 63.75,41.91 v70.87,49.02
  Bottom 0.508: v70.87,49.02 v86.61,49.02
ETH_TX_EN  (via drill 0.6)
  Top 0.203: 137.16,58.67 U3.19 | U3.19
  Top 0.508: v84.84,43.69 127,43.69 137.16,53.85 137.16,58.67
  Bottom 0.508: v84.84,43.69 74.42,43.69 72.64,41.91 R57.2
ETH_TXD0
  Top 0.203: 137.52,59.44 137.5,59.45 U3.20
  Top 0.305: 137.92,59.44 137.52,59.44
  Top 0.508: 137.92,59.44 142.75,54.61 142.75,48.77 135.89,41.91 77.47,41.91 77.22,42.16 R58.2
ETH_TXD1
  Top 0.203: 137.54,59.97 137.52,59.95 U3.21
  Top 0.254: 138.68,59.95 138.68,59.94
  Top 0.305: 138.68,59.95 138.66,59.97 137.54,59.97
  Top 0.508: 138.68,59.94 143.76,54.86 143.76,48.26 136.4,40.89 R61.2
GND  (via drill 0.25, 0.38)
  Top 0.203: U3.22 135.38,60.45
  Top 0.254: U1.99 59.27,57.15 v59.94,57.15 | U1.74 73.32,53.76 v73.41,53.85 | 135.38,60.45 U3.PAD v135.89,59.44 | U1.27 59.27,39.97 58.93,39.62 58.42,39.62 57.91,40.13 57.66,40.13 v57.15,40.64 | U1.20 57.71,44.76 v58.67,45.72
  Top 0.305: U1.10 63.52,49.76 v64.52,49.53 | C75.1 131.72,56.62 v131.42,56.31
  Top 0.356: 26.04,30.23 OPAMP2.4 | ADC4.4 31,23.12 30.48,22.61 v28.7,22.61 | ADC3.4 31.76,30.49 30.99,29.72 30.99,28.19 30.48,27.69 v28.7,27.69 | ADC2.4 31,39.12 30.48,38.61 v28.7,38.61 | ADC1.4 31.76,46.49 30.99,45.72 30.99,44.2 30.48,43.69 v28.7,43.69
  Top 0.61: 26.04,30.23 26.04,28.83 v26.42,28.45 | v26.42,44.45 26.04,44.83 OPAMP1.4
  Top 1.016: SW1.4 SW1.2
  Bottom 0.356: v28.7,22.61 28.7,26.16 v26.42,28.45 27.18,28.45 27.94,27.69 v28.7,27.69 | v28.7,38.61 28.7,42.16 v26.42,44.45 27.18,44.45 27.94,43.69 v28.7,43.69
  other vias: 134.37,60.96 32.77,21.84 32.77,29.21 32.77,37.85 32.77,45.21 39.88,45.47 66.29,53.34 67.06,43.18 70.87,43.69 73.38,43.87 70.36,68.33 73.91,57.4 75.31,56.79 42.42,24.38 49.78,24.38 50.04,31.5 58.17,34.04 44.96,28.7 52.58,28.45 59.69,43.59 138.43,71.63 128.52,43.18 125.48,47.75 51.82,72.9 53.09,68.83 67.51,36.83 66.55,29.72 67.06,49.02 64.24,46.63 74.5,63.75 62.99,38.35 57.4,60.96 58.93,60.71 49.28,64.01 61.47,64.01 57.66,56.39 54.36,58.67 76.71,53.09 80.77,57.4 83.31,59.94 86.36,62.48 88.65,62.48 91.44,60.2 89.66,58.17 89.66,48.26 96.77,55.37 102.87,55.63 97.03,48.26 103.12,48.26 109.98,48.26 117.35,48.26 123.95,51.56 133.07,54.94 127.51,55.12 122.68,55.63 112.45,55.73 138.25,64.21 39.88,41.4 39.88,32.77 39.12,26.42 39.88,48.77 124.71,29.97 120.14,30.73 121.92,33.53 112.78,31.24 111.76,28.19 130.56,28.19 104.39,35.31 97.54,34.8 81.28,38.1 79.25,36.07 89.66,28.96 90.93,15.24 80.77,23.88 78.74,21.59 78.99,8.89 80.77,10.67 134.11,9.4 70.31,37.34 52.32,22.86 61.47,32 56.39,27.18 52.83,42.42 53.34,41.15 46.74,41.4 53.85,33.53 57.15,36.83 53.59,39.12 50.29,36.58 47.75,32.51 43.43,37.08 37.59,36.07 37.59,28.7 37.59,44.2 42.67,40.89 42.42,44.96 42.16,50.29 35.81,56.64 32.51,56.13 26.16,59.44 17.02,56.13 108.71,77.47 107.44,75.18 110.49,73.66 117.86,74.17 121.41,74.42 120.14,72.14 116.59,70.1 31.5,42.93 31.5,34.29 31.75,27.69 31.5,50.29 10.41,38.86 12.7,31.5 58.42,49.28 122.94,44.7 126.49,44.7 126.24,51.05 131.57,52.32 138.43,56.64 141.73,54.1 138.18,54.36 141.73,49.28 138.18,45.97 10.16,71.12 20.32,71.12 10.16,60.96 10.16,50.8 20.32,50.8 10.16,40.64 20.32,40.64 10.16,30.48 10.16,20.32 10.16,10.16 40.64,10.16 50.8,10.16 60.96,10.16 71.12,10.16 101.6,10.16 111.76,10.16 121.92,10.16 132.08,10.16 132.08,20.32 111.76,20.32 101.6,20.32 71.12,20.32 50.8,20.32 40.64,20.32 30.48,20.32 20.32,20.32 40.64,50.8 40.64,71.12 60.96,71.12 60.96,60.96 40.64,60.96 30.48,60.96 30.48,50.8 101.6,71.12 152.4,71.12 152.4,60.96 142.24,60.96 152.4,50.8 152.4,40.64 142.24,40.64 142.24,30.48 152.4,30.48 152.4,20.32 142.24,20.32 142.24,10.16 152.4,10.16 132.08,30.48 111.76,30.48 101.6,30.48 91.44,30.48 10.16,1.02 20.32,1.02 30.48,1.02 40.64,1.02 50.8,1.02 60.96,1.02 71.12,1.02 81.28,1.02 91.44,1.02 101.6,1.02 111.76,1.02 121.92,1.02 132.08,1.02 142.24,1.02 152.4,1.02 160.27,1.02 160.27,10.16 160.27,30.48 160.27,40.64 160.27,50.8 160.27,60.96 160.27,71.12 160.27,79.76 152.4,79.76 142.24,79.76 101.6,79.76 91.44,79.76 81.28,79.76 71.12,79.76 60.96,79.76 50.8,79.76 40.64,79.76 30.48,79.76 20.32,79.76 10.16,79.76 1.02,71.12 1.02,60.96 1.02,50.8 1.02,40.64 1.02,30.48 1.02,20.32 1.02,10.16 1.02,1.02 1.02,79.76 114.81,67.82 76.53,68.07
  pour Route3: 0,80.77 161.29,80.77 161.29,28.19 152.91,28.19 152.91,75.69 34.54,75.69 34.54,63.25 6.6,63.25 6.6,3.56 94.74,3.56 105.41,11.94 105.92,11.94 105.92,2.03 161.29,2.03 161.29,0 0,0
  pour Top (isolate 0.254, rank 2): 0,80.77 161.29,80.77 161.29,0 0,0
  pour Bottom (isolate 0.254, rank 2): 0,80.77 161.29,80.77 161.29,0 0,0
  pour Route2: 0,80.77 161.29,80.77 161.29,0 0,0
  cutout Route2 (no thermals): 28.19,23.11 29.21,23.11 29.21,22.1 28.19,22.1
  cutout Route2 (no thermals): 28.19,39.12 29.21,39.12 29.21,38.1 28.19,38.1
  cutout Route2 (no thermals): 28.19,28.19 29.21,28.19 29.21,27.18 28.19,27.18
  cutout Route2 (no thermals): 28.19,44.2 29.21,44.2 29.21,43.18 28.19,43.18
JTAG_TCK  (via drill 0.25)
  Top 0.305: v70.87,58.17 70.77,58.07 U1.76
  Bottom 0.305: J22.TCK 74.55,61.85 v70.87,58.17
JTAG_TDI  (via drill 0.25)
  Top 0.305: v70.61,63.75 70.27,63.41 U1.77
  Bottom 0.305: J22.TDI 71.25,64.39 v70.61,63.75
JTAG_TDO  (via drill 0.25)
  Top 0.305: v64.49,60.17 64.27,59.95 U1.89
  Bottom 0.305: J22.TDO 67.44,63.12 v64.49,60.17
JTAG_TMS  (via drill 0.25)
  Top 0.305: U1.72 74.1,52.76 v74.68,53.34
  Bottom 0.305: v74.68,53.34 74.68,57.53 J22.TMS
LAT_AXIS_IN
  Top 0.61: R1.1 9.83,48.69 7.62,46.48 JP5.4
MCO1-ETH-CLK
  Top 0.203: U3.8 132.85,60.95
  Top 0.305: 132.85,60.95 132.08,61.21
  Top 0.508: 132.08,61.21 86.36,61.21 76.27,51.12 R68.2
N$1
  Top 0.61: R3.2 26.33,48.69 C12.1 C13.1 27.3,47.72 OPAMP1.3
N$2
  Top 0.61: OPAMP1.5 26.04,37.93 | C17.1 26.16,37.93 26.04,37.93 | 26.04,37.93 C16.1 23.6,37.93 R6.2
N$3
  Top 0.61: R19.2 25.06,21.84 C38.1 25.91,21.93 26.04,21.93 | 26.04,21.93 C39.1 | OPAMP2.5 26.04,21.93
N$4
  Top 0.61: R2.2 R3.1 23.47,47.85 23.19,47.12 C11.1
N$5
  Top 0.61: C37.1 22.21,22.59 R19.1 R18.2
N$8
  Top 0.61: C15.1 22.21,38.59 R6.1 R5.2
N$10
  Top 0.61: R18.1 17.91,21.84 C36.1 16.02,21.71 R17.2
N$11
  Top 0.61: R5.1 17.91,37.85 C14.1 16.02,37.72 R4.2
N$12
  Top 0.61: R9.2 26.33,32.77 C20.1 27.69,32.68 | 27.69,32.68 C21.1 | OPAMP2.3 27.3,32.3 27.69,32.68
N$13
  Top 0.61: R8.2 R9.1 23.48,32.02 C19.1
N$15
  Top 0.254: R59.2 139.45,60.96 139.95,61.47 139.95,63.63 138.94,64.64 138.94,66.55 139.19,66.8 139.19,71.88 136.4,74.68 133.6,74.68 132.59,75.69 130.81,75.69 X8.20
N$16
  Top 0.61: R7.2 18.92,32.77 C18.1 20.81,32.9 R8.1
N$17
  Top 0.61: R12.2 123.95,28.54 VR2.2
N$18
  Top 0.61: VR2.3 122.68,28.7 121.92,29.46 R14.2 123.52,30.65 R13.2
N$19
  Top 0.61: VR2.5 C33.2
N$20
  Top 0.406: VR2.6 118.76,25.96 C32.1 118.76,30.08 117.51,31.33 R11.1 115.49,31.33 R15.2
N$21
  Top 0.203: U3.6 133.86,62.08 133.86,62.38
  Top 0.254: 133.86,62.38 133.4,62.87 133.4,69.62 131.06,71.96 131.06,73.91 131.83,74.68 X8.11
N$22
  Top 0.61: R1.2 19.1,48.69 C10.1 20.86,48.77 R2.1
N$23
  Top 0.508: R28.2 LED2.A
N$24
  Top 0.508: R29.2 LED3.A
N$25
  Top 0.254: LED1.3 64.44,32.48 R26.2
N$26
  Top 0.203: 134.37,62.07 U3.5 134.38,62.42 134.37,62.43
  Top 0.254: 134.37,62.43 133.78,63.02 133.78,69.8 131.44,72.14 131.44,73.15 132.08,73.66 132.59,73.66 132.84,73.41 132.84,73.15 X8.10
N$27
  Top 0.203: U3.4 134.88,64.01
  Top 0.254: 134.88,64.01 136.02,65.15 136.02,71.96 135.38,72.59 134.65,72.59 134.47,72.42 134.47,72.14 134.87,71.73 X8.4
N$28
  Top 0.203: U3.3 135.38,63.95
  Top 0.254: 135.38,63.95 136.4,64.97 136.4,72.14 X8.5
N$29
  Top 0.305: IC2.17 121.15,72.47 R_LED.1
N$30
  Top 0.254: IC2.14 124.98,70.08 C44.1
N$31
  Top 0.254: LED1.4 71.23,32.48 R25.2
N$32
  Top 0.254: R27.2 66.51,34.54 LED1.1
N$34
  Top 0.305: IC2.23 117.59,69.58 114.81,66.8 D5.P$2
N$35
  Top 0.305: IC2.4 120.65,64.6 R23.1
N$36
  Top 0.305: IC2.5 121.15,65.37 R24.1
N$42
  Top 0.61: JP3.6 59.44,19.14 C96.1 57.49,22.94 R45.1
N$43
  Top 0.305: U1.6 53.99,51.76 R36.2
N$45
  Top 0.61: JP3.5 61.98,21.17 C95.1 61.81,22.94 R46.1
N$46
  Top 0.61: JP3.4 64.52,19.81 64.26,20.07 64.26,20.99 C94.1 64.17,22.94 R47.1
N$47
  Top 0.61: JP3.3 67.06,19.9 C93.1 68.24,22.94 R48.1
N$48
  Top 0.61: JP4.4 24.22,76.29 C104.1 24.13,73.32 24.13,71.88 23.71,71.46 R49.1
N$49
  Top 0.61: JP4.3 27.52,75.86 C103.1 27.43,73.32 27.43,72.14 26.67,71.37 R51.1
N$50
  Top 0.61: JP4.2 29.63,76.29 C102.1 29.63,71.55 R52.1
N$51
  Top 0.61: JP4.1 34.04,74.42 C101.1 34.2,72.57 R53.1
N$52
  Top 0.61: R41.1 57.15,73.01 C112.1 56.91,75.93 JP2.4
N$53
  Top 0.61: R42.1 53.09,73.37 C111.1 53.07,75.68 JP2.3
N$54
  Top 0.61: R43.1 50.29,73.06 C110.1 51.31,74.08 JP2.2
N$55
  Top 0.61: JP2.1 48.77,75.35 C109.1 46.82,72.06 R44.1
N$56
  Top 0.508: R30.2 LED4.A
N$57
  Top 0.508: R31.2 LED5.A
N$58
  Top 0.254: U1.42 66.77,38.64 68.33,37.08 68.33,34.04 68.83,33.53 LED1.5
N$59
  Top 0.254: LED1.2 67.56,33.53 67.82,33.78 67.82,35.31 65.77,37.35 U1.40
N$60
  Top 0.254: LED1.6 69.09,35.09 69.09,37.08 67.77,38.4 U1.44
N$61
  Top 0.61: C120.1 90.68,72.81 | 90.68,72.81 R50.1 | 90.68,72.81 90.68,76.2 JP1.3
N$62
  Top 0.61: R37.1 87.38,72.56 C119.1 87.9,73.24 JP1.4
N$63
  Top 0.61: R39.1 85.43,71.3 C118.1 85.43,76.29 JP1.5
N$64
  Top 0.61: R40.1 81.79,72.22 C117.1 82.13,75.78 JP1.6
N$65
  Top 1.27: POE.7 120.7,53.03 R54.2
N$66
  Top 0.813: R54.1 115.52,50.6 POE.6
N$67  (via drill 0.33)
  Top 0.813: R54.3 120.58,49.78 v121.16,49.78
  Bottom 0.813: v121.16,49.78 127.51,49.78 POE.8
N$68
  Top 0.254: U1.5 56.99,52.25 54.69,52.25 53.85,53.09 LED5.C
N$69
  Top 0.254: U1.4 55.24,52.76 53.63,54.37 LED4.C
N$70
  Top 0.254: U1.2 57.04,53.77 56.08,53.77 53.72,56.13 LED3.C
N$71
  Top 0.254: LED2.C 54.86,57.4 57.4,54.86 59.44,54.86 59.77,55.2 U1.98
N$72
  Top 0.203: 133.53,58.17 133.88,58.17 U3.13
  Top 0.508: R35.1 133.53,58.17
N$73
  Top 0.305: U1.29 60.27,39.44 59.94,39.12
  Top 0.508: R33.2 59.44,38.61 59.94,39.12
N$74
  Top 0.203: 132.74,58.83 133.38,58.95 U3.12
  Top 0.508: R34.1 130.56,57.66 131.95,58.7 132.74,58.83
N$75  (via drill 0.6)
  Top 0.305: 69.77,41.58 U1.48
  Top 0.508: v70.1,41.91 69.77,41.58
  Bottom 0.508: R57.1 v70.1,41.91
N$76
  Top 0.305: 71.12,42.42 71.46,42.76 U1.52
  Top 0.508: R61.1 72.14,40.89 71.12,41.91 71.12,42.42
N$77
  Top 0.305: U1.51 73.31,42.26 73.41,42.16
  Top 0.508: 73.41,42.16 R58.1
N$78
  Top 0.203: U3.16 135.38,57.92
  Top 0.305: 135.38,57.92 135.38,57.15
  Top 0.508: 135.38,57.15 135.38,56.64 R62.1
N$79
  Top 0.203: U3.9 132.85,60.45
  Top 0.305: 132.85,60.45 131.83,60.45 R60.2
N$80
  Top 0.203: U3.1 136.88,62.56
  Top 0.254: 136.88,62.56 C77.1 C76.1
N$81  (via drill 0.6)
  Top 0.305: U1.16 57.94,46.76
  Top 0.508: 57.94,46.76 v62.05,46.97
  Bottom 0.508: v62.05,46.97 R65.1
N$82
  Top 0.254: X8.12 C99.2
N$83
  Top 0.203: U3.18 136.38,57.93
  Top 0.254: 136.38,57.93 136.14,57.66
  Top 0.508: 136.14,57.66 R63.1
N$84
  Top 0.203: 134.83,57.74 U3.15
  Top 0.305: 134.52,56.92 134.83,57.74
  Top 0.508: 134.52,56.92 134.11,56.39 R64.1
N$85  (via drill 0.6)
  Top 0.305: U1.25 57.31,42.26 v58.17,42.16
  Bottom 0.508: v58.17,42.16 R66.1
N$86
  Top 0.305: U1.67 73.88,50.26 73.91,50.29
  Top 0.508: 73.91,50.29 74.42,50.8 R68.1
N$87
  Top 0.203: U3.10 130.78,59.95
  Top 0.305: 130.78,59.95 R67.1
N$88
  cutout Route2: 34.54,62.99 35.05,62.99 35.05,21.34 81.79,21.34 81.79,20.83 34.54,20.83
N$89
  cutout Route2: 128.02,76.2 128.78,76.96 128.78,54.86 142.24,54.86 142.24,49.02 128.02,49.02 128.02,49.53 141.73,49.53 141.73,54.36 128.02,54.36
NRST  (via drill 0.25)
  Top 0.254: J22.!RESET 77.72,66.04 78.49,66.8 87.88,66.8 89.27,65.42 C92.1 92.7,65.42 SW1.3
  Top 0.305: v59.44,48.51 58.68,47.76 U1.14
  Top 1.016: SW1.3 SW1.1
  Bottom 0.305: J22.!RESET 67.56,65.66 60.96,59.44 60.96,50.04 v59.44,48.51
OSC_IN
  Top 0.254: U1.12 56.13,48.76 54.86,47.5 50.8,47.5 49.6,48.7 Q1.1
  Top 0.61: C43.1 48.66,48.94 Q1.1
OSC_OUT
  Top 0.254: U1.13 56.39,48.26 55.12,46.99 53.59,46.99 51.82,45.21 51.82,44.72 Q1.3
  Top 0.61: Q1.3 51.96,44.54 C45.1
POE+  (via drill 0.51, 0.6)
  Top 0.305: IC2.21 119.15,73.94 119.63,74.42 119.63,74.91 D3.P$2
  Top 0.813: 119.63,74.91 119.36,75.18 119.38,75.18 117.86,76.71
  Top 1.016: C51.1 107.93,72.03 R99.1 107.53,71.36 C48.1 110.22,71.36 111.78,72.92 C53.+ 115.81,72.92 v117.09,71.63
  Top 1.27: C51.1 110.23,75.96 D4.C 117.86,76.71 v127.51,76.71 | X8.13 141.99,73.41 v138.18,77.22
  Route2 1.27: v127.51,76.71 129.54,78.74 136.65,78.74 v138.18,77.22
  pour Route3 (no thermals): 112.78,48.26 112.78,72.64 118.11,72.64 118.11,61.47 128.27,61.47 128.27,54.36 141.73,54.36 141.73,48.26
  pour Top (no thermals): 141.99,52.58 141.99,50.8 139.19,48.26 134.87,48.26 134.87,50.29 135.13,50.55 137.67,52.83 139.19,54.1 140.46,54.1
POE-  (via drill 0.38, 0.51, 0.6)
  Top 0.254: IC2.11 121.41,68.58 | 121.41,68.58 121.16,68.58 | 121.16,68.58 IC2.PAD | IC2.10 121.15,68.08 IC2.PAD | IC2.9 122.16,67.58 121.16,68.58 | IC2.8 122.15,67.08 v121.67,67.56 | v121.67,67.56 IC2.PAD | IC2.12 121.15,69.08 IC2.PAD | IC2.13 121.65,69.58 IC2.PAD | IC2.7 122.15,67.84 121.41,68.58 | IC2.3 120.15,68.08 IC2.PAD | IC2.2 119.65,67.58 IC2.PAD | IC2.1 119.15,67.08 IC2.PAD | IC2.15 122.15,70.08 IC2.PAD | IC2.19 120.15,69.08 IC2.PAD | IC2.6 121.65,67.55 v121.67,67.56
  Top 0.305: v121.67,67.56 122.14,67.56 122.16,67.58
  Top 0.61: C133.2 C130.2 136.26,47.36 135.89,46.99 C129.2
  Top 0.813: R23.2 R24.2 123.02,62.65 v123.44,62.74 | v125.22,66.29 C44.2 | v119.63,69.6 120.15,69.08
  Top 1.016: C53.- 112.29,68.82 v111.76,69.34 111.74,69.36 C48.2
  Top 1.422: C129.2 v133.48,46.35 v132.46,46.35
  other vias: 119.63,67.56 121.67,69.6 134.49,46.35
  pour Route3 (no thermals): 101.85,75.18 128.27,75.18 128.27,61.98 118.62,61.98 118.62,73.15 112.27,73.15 112.27,47.75 141.73,47.75 141.73,45.47 101.85,45.47
POE_LED+
  Bottom 0.813: X8.17 119.38,64.52 117.86,62.99 L2.1
POE_LED-
  Top 0.813: X8.18 129.79,69.09 127.25,71.63 124.04,71.63 R_LED.2 122.94,72.73 D3.P$1
PSE_OUTPUT
  Top 1.016: C51.2 105.83,73.56 R99.2 105.83,69.02 105.92,68.94 D5.P$1
  Top 1.27: X8.14 139.45,78.74 108.2,78.74 D4.A 105.93,76.48 C51.2
  pour Top (no thermals): 118.62,68.58 117.86,68.58 114.55,65.53 108.2,65.53 106.43,67.31 105.66,67.31 105.66,66.29 107.44,64.52 115.06,64.52 117.6,67.06 117.6,67.31 117.86,67.56 118.62,67.56
PWM_AXIS3_U_OUT  (via drill 0.25)
  Top 0.254: U1.64 74.94,48.76 77.98,48.77 87.38,58.17 v87.38,59.69 | v87.38,68.07 R37.2 87.12,69.34
  Bottom 0.254: v87.38,59.69 v87.38,68.07
PWM_AXIS3_V_OUT  (via drill 0.25)
  Top 0.254: U1.63 78.49,48.26 v89.92,59.69 | v89.92,68.07 89.92,68.58 90.68,69.34 R50.2
  Bottom 0.254: v89.92,59.69 v89.92,68.07
PWM_AXIS4_U_OUT  (via drill 0.25)
  Top 0.254: U1.66 76.68,49.76 v81.79,54.86 | v81.79,68.07 R40.2
  Bottom 0.254: v81.79,54.86 v81.79,68.07
PWM_AXIS4_V_OUT  (via drill 0.25)
  Top 0.254: U1.65 77.49,49.26 79.76,51.56 85.09,56.9 v85.09,58.17 | v85.09,68.07 R39.2
  Bottom 0.254: v85.09,58.17 v85.09,68.07
PWM_LAT_U_OUT  (via drill 0.25)
  Top 0.254: v68.58,29.46 R48.2
  Top 0.305: v68.58,41.91 68.58,45.72 70.61,47.75 71.6,47.75 71.87,47.76 U1.62
  Bottom 0.254: v68.58,41.91 v68.58,29.46
PWM_LAT_V_OUT  (via drill 0.25)
  Top 0.254: U1.61 72.51,47.24 | v64.52,29.21 R47.2
  Top 0.305: v69.34,43.69 69.34,45.72 70.87,47.24 72.11,47.24 72.12,47.26 U1.61
  Bottom 0.254: v69.34,43.69 64.52,38.86 v64.52,29.21
PWM_VERT_U_OUT  (via drill 0.25)
  Top 0.254: v61.47,26.67 R46.2
  Top 0.305: U1.60 73.86,46.76 v77.7,42.92
  Bottom 0.254: v77.7,42.92 77.7,36.55 68.58,27.43 62.23,27.43 v61.47,26.67
PWM_VERT_V_OUT  (via drill 0.25)
  Top 0.254: R45.2 57.15,25.15 v58.67,26.67
  Top 0.305: U1.59 73.6,46.26 v76.93,42.93
  Bottom 0.254: v58.67,26.67 60.45,28.45 68.58,28.45 76.93,36.8 v76.93,42.93
REF_MONITOR  (via drill 0.25)
  Top 0.254: U1.15 56.4,47.26 v55.88,46.74 | v34.8,57.66 33.62,57.66 C22.1
  Top 0.61: C22.1 31.49,57.75 | 31.49,57.75 R16.2 | 31.49,57.75 R10.2
  Bottom 0.254: v55.88,46.74 47.24,46.74 36.32,57.66 v34.8,57.66
SDO1
  Top 0.305: ADC2.9 35.06,40.12 34.8,40.39 34.8,45.97 35.31,46.48 ADC1.7
SDO2
  Top 0.305: ADC3.9 35.31,31.49 35.31,31.5 35.05,31.5 34.54,32 34.54,38.35 35.31,39.12 ADC2.7
SDO3
  Top 0.305: ADC3.7 36.08,30.49 36.07,30.48 35.31,30.48 34.54,29.72 34.54,24.89 35.31,24.13 ADC4.9
SDO4
  Top 0.356: 38.61,23.11 38.09,23.12 ADC4.7
  Top 0.508: 38.61,23.11 R20.1
SPI_MISO
  Top 0.254: 61.47,39.62 64.52,39.62 64.77,39.88 U1.38
  Top 0.305: U1.31 61.27,39.82 61.47,39.62
  Top 0.508: 61.47,39.62 61.47,33.78 50.8,23.11 R20.2
SPI_SCK  (via drill 0.5, 0.6)
  Top 0.356: ADC3.8 v38.1,30.99 | ADC4.8 37.85,23.62 v38.35,24.13 | ADC2.8 v38.1,39.62 | ADC1.8 38.1,46.99 v38.35,46.74
  Top 0.508: R32.1 60.45,34.8 v55.37,29.72
  Bottom 0.508: v38.35,24.13 40.13,25.91 46.23,25.91 | v38.1,39.62 45.47,39.62 | 45.47,39.62 v55.37,29.72 51.56,25.91 46.23,25.91 | v38.35,46.74 42.42,46.74 45.47,43.69 45.47,39.62 | v38.1,30.99 41.15,30.99 46.23,25.91
SPI_SCK_MCU
  Top 0.305: U1.30 60.77,38.93
  Top 0.356: 60.77,38.93 60.45,38.61
  Top 0.508: 60.45,38.61 R32.2
TP1  (via drill 0.33)
  Top 0.254: U1.1 56.74,54.26 54.61,56.39 54.2,56.79 TP1.TP
  other vias: 53.44,56.79
TP2  (via drill 0.33)
  Top 0.254: U1.3 55.58,53.26 53.59,55.24 TP2.TP
  other vias: 45.21,55.24
TP3  (via drill 0.33)
  Top 0.254: U1.80 68.77,59.88 TP3.TP
  other vias: 68.96,60.07
TP4  (via drill 0.33)
  Top 0.254: U1.8 57.01,50.8 TP4.TP
  other vias: 55.88,50.8
TP5  (via drill 0.33)
  Top 0.254: U1.41 66.27,37.87 TP5.TP
  other vias: 66.7,37.54
TP6  (via drill 0.33)
  Top 0.305: U1.53 75.01,43.26 TP6.TP
  other vias: 76.02,42.9
TP7  (via drill 0.33)
  Top 0.305: TP7.TP 55.12,40.13 56.13,41.15 56.13,42.93 56.47,43.26 U1.23
  other vias: 51.56,40.13
USB_D+
  Top 0.254: R22.2 72.39,57.4
  Top 0.305: U1.71 71.87,52.26 71.12,53.01 71.12,54.15 72.06,55.09 72.06,57.02 72.39,57.4
USB_D-
  Top 0.305: U1.70 71.73,51.76 70.69,52.81 70.69,54.36 71.6,55.27 R21.2
USB_ID  (via drill 0.38)
  Top 0.254: v69.6,61.47 69.6,69.34 70.87,70.61 70.87,72.4 X4.4
  Top 0.305: U1.69 71.42,51.26 69.6,53.09 v69.6,54.36
  Bottom 0.254: v69.6,54.36 v69.6,61.47
USB_VBUS
  Top 0.254: 73.41,72.26 X4.1
  Top 0.279: U1.68 73.29,50.76 73.53,51 73.53,51.21 76.38,54.05 76.38,56.72 73.66,59.44 73.66,67.98 C46.1 73.41,68.24 73.41,72.26
VCAP_1
  Top 0.305: C87.1 70.27,38.63 U1.49
VCAP_2
  Top 0.305: U1.73 73.58,53.26 75.18,54.86 C86.1
VDDA
  Top 0.254: X8.6 C54.2
VDDA_3.3
  Top 0.203: U3.2 135.88,62.47
  Top 0.305: 135.88,62.47 136.22,62.82 C98.2
  Top 0.406: C98.2 136.22,63.83 137.28,64.89 C97.2 137.28,66.89 L3.1
VERT_AXIS_IN
  Top 0.61: R4.1 14.59,38.24 8.89,43.94 JP5.3
WATCHDOG_AXIS3_OUT
  Top 0.254: U1.82 67.77,56.49 67.77,66.34 65.53,68.58 54.52,68.58 R42.2
  Top 0.305: U1.82
WATCHDOG_AXIS4_OUT
  Top 0.254: U1.84 66.77,56.43 66.78,56.44 66.78,65.81 65.02,67.56 52.07,67.56 50.55,69.09 47.41,69.09 R44.2
WATCHDOG_LAT_OUT  (via drill 0.25)
  Top 0.254: R49.2 23.62,69.85 v24.89,68.58 | U1.57 71.83,45.26 71.93,45.26 71.07,45.26 70.74,45.59 v70.74,46.35
  Route2 0.254: v70.74,46.35 68.2,46.35 66.8,48.01 61.21,48.01 v58.67,50.55
  Bottom 0.254: v58.67,50.55 46.74,62.48 30.99,62.48 v24.89,68.58
WATCHDOG_VERT_OUT
  Top 0.254: 65.79,56 65.79,66.04 64.77,67.06 51.82,67.06 50.29,68.58 30.99,68.58 30.06,69.51
  Top 0.305: U1.86 65.79,56 | 30.06,69.51 R52.2

## Text on the board
tPlace: RTx Controller | Rob Gaskell | Robin Davis | Robert Corkran
bPlace: RTx Controller | Rob Gaskell | Robin Davis | Robert Corkran
tNames: D3